# EAGLE schematic main (EAGLE 8.4.0)
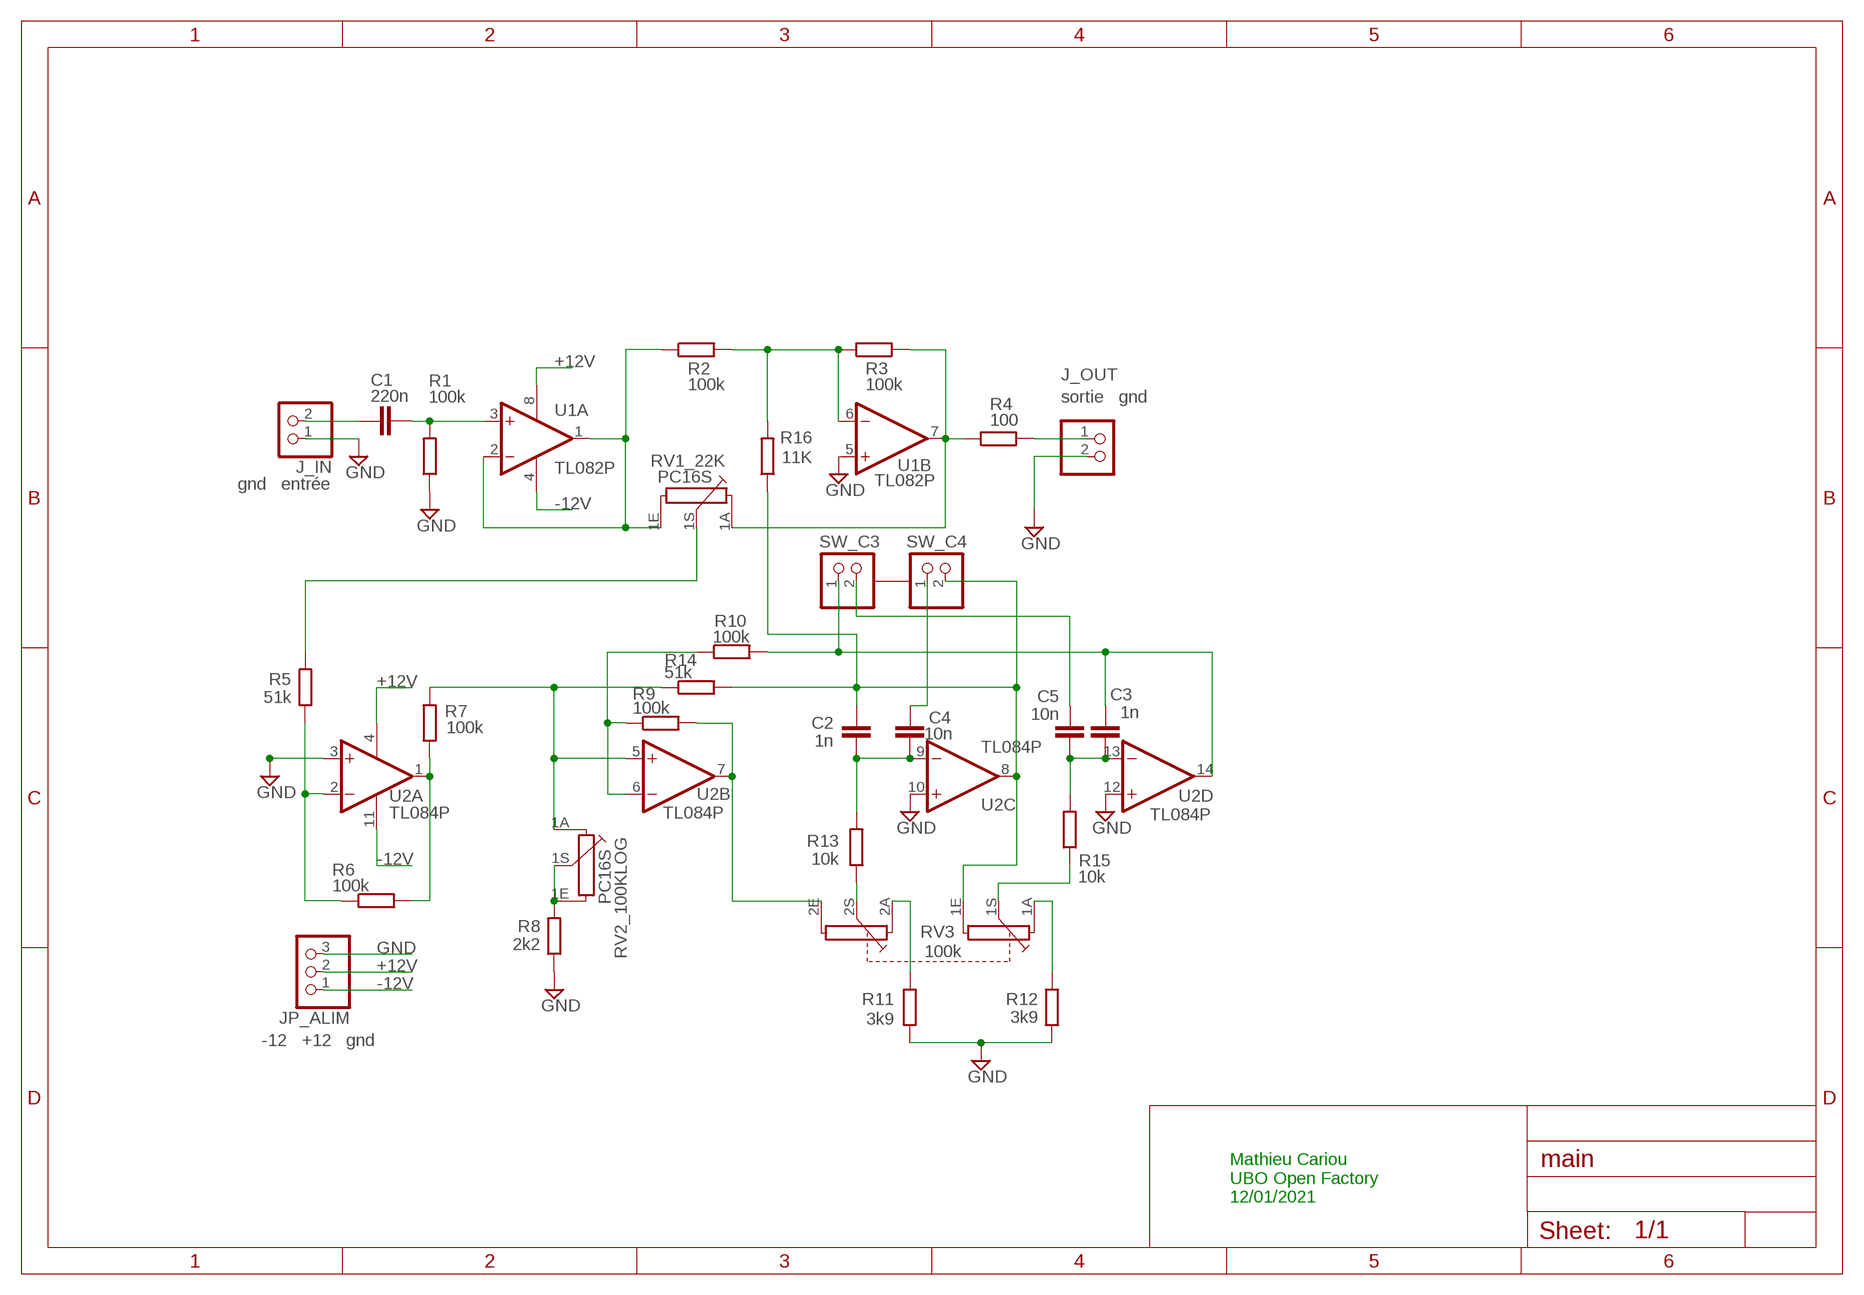
[diagram p0: schematic, sheet 1]

## Parts
C1  220n  C-EU050-030X075  [C050-030X075]
C2  1n  C-EU050-030X075  [C050-030X075]
C3  1n  C-EU050-030X075  [C050-030X075]
C4  10n  C-EU050-030X075  [C050-030X075]
C5  10n  C-EU050-030X075  [C050-030X075]
J_IN  gnd entrée  PINHD-1X2  [1X02]
J_OUT  sortie gnd  PINHD-1X2  [1X02]
JP_ALIM  -12 +12 gnd  PINHD-1X3  [1X03]
R1  100k  R-EU_0204/7  [0204/7]
R2  100k  R-EU_0204/7  [0204/7]
R3  100k  R-EU_0204/7  [0204/7]
R4  100  R-EU_0204/7  [0204/7]
R5  51k  R-EU_0204/7  [0204/7]
R6  100k  R-EU_0204/7  [0204/7]
R7  100k  R-EU_0204/7  [0204/7]
R8  2k2  R-EU_0204/7  [0204/7]
R9  100k  R-EU_0204/7  [0204/7]
R10  100k  R-EU_0204/7  [0204/7]
R11  3k9  R-EU_0204/7  [0204/7]
R12  3k9  R-EU_0204/7  [0204/7]
R13  10k  R-EU_0204/7  [0204/7]
R14  51k  R-EU_0204/7  [0204/7]
R15  10k  R-EU_0204/7  [0204/7]
R16  11K  R-EU_0204/7  [0204/7]
RV1_22K  PC16S  [PC16S]
RV2_100KLOG  PC16S  [PC16S]
RV3  100k  PC16D  [PC16D]
SW_C3  PINHD-1X2  [1X02]
SW_C4  PINHD-1X2  [1X02]
U1  TL082P  [DIL08]
U2  TL084P  [DIL14]

## Nets
+12V: JP_ALIM.2 U1.8(P:V+) U2.4(P:V+)
-12V: JP_ALIM.1 U1.4(P:V-) U2.11(P:V-)
GND: J_IN.1 J_OUT.2 JP_ALIM.3 R1.1 R8.1 R11.1 R12.1 U1.5(B:+IN) U2.3(A:+IN) U2.10(C:+IN) U2.12(D:+IN)
N$1: C1.2 R1.2 U1.3(A:+IN)
N$2: R2.1 RV1_22K.1E U1.1(A:OUT) U1.2(A:-IN)
N$3: R3.2 R4.1 RV1_22K.1A U1.7(B:OUT)
N$4: R2.2 R3.1 R16.2 U1.6(B:-IN)
N$5: C2.2 R14.2 R16.1 RV3.1E SW_C4.2 U2.8(C:OUT)
N$6: C1.1 J_IN.2
N$7: J_OUT.1 R4.2
N$8: R5.2 RV1_22K.1S
N$9: R5.1 R6.1 U2.2(A:-IN)
N$10: R6.2 R7.1 U2.1(A:OUT)
N$11: R9.1 R10.1 U2.6(B:-IN)
N$12: R7.2 R14.1 RV2_100KLOG.1A U2.5(B:+IN)
N$13: R8.2 RV2_100KLOG.1E RV2_100KLOG.1S
N$14: R9.2 RV3.2E U2.7(B:OUT)
N$15: R11.2 RV3.2A
N$16: R12.2 RV3.1A
N$18: R13.1 RV3.2S
N$19: R15.1 RV3.1S
N$20: C3.2 R10.2 SW_C3.1 U2.14(D:OUT)
N$21: C2.1 C4.1 R13.2 U2.9(C:-IN)
N$22: C3.1 C5.1 R15.2 U2.13(D:-IN)
N$23: C4.2 SW_C4.1
N$24: C5.2 SW_C3.2

## Notes on the sheet
- Mathieu Cariou
  UBO Open Factory
  12/01/2021

## Library data of the parts
C1-C5 = rcl:C-EU: CAPACITOR, European symbol; SPICEPREFIX: C
J_IN J_OUT SW_C3 SW_C4 = pinhead:PINHD-1X2: PIN HEADER
JP_ALIM = pinhead:PINHD-1X3: PIN HEADER
R1-R16 = rcl:R-EU_: RESISTOR, European symbol; SPICEPREFIX: R
RV1_22K RV2_100KLOG = piher:PC16S: POTENTIOMETER single carbon potentiometer, 16 mm, S3ROH; OC_FARNELL: 4452940; OC_NEWARK: unknown
RV3 = piher:PC16D: POTENTIOMETER tandem carbon potentiometer, 16 mm, S3ROH; OC_FARNELL: 4453049; OC_NEWARK: unknown
U1 = linear:TL082: OP AMP Data sheet <http://www.ti.com/lit/ds/symlink/tl084a . pdf>; DATA_SHEET: <a href="http://www.ti.com/lit/ds/symlink/tl084a.pdf"> Data sheet </a>
U2 = linear:TL084: OP AMP

## Net classes
0 default: width 0.787 mm, clearance 0.508 mm